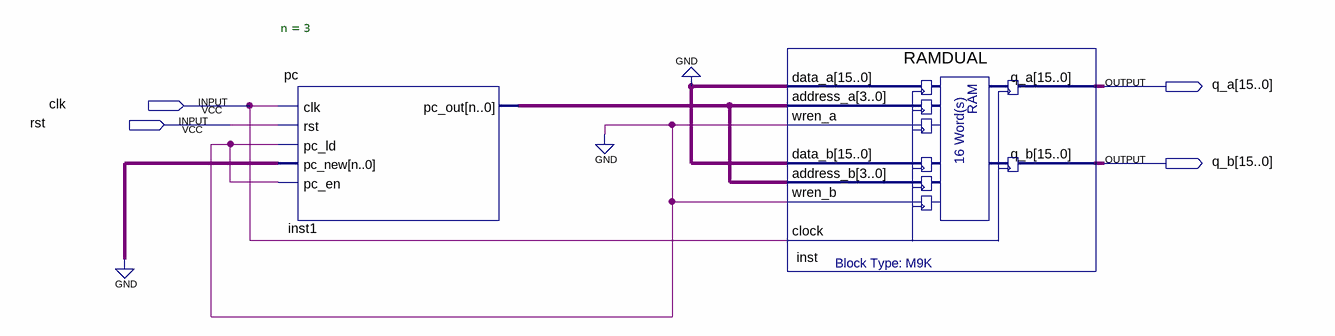
[diagram p0: schematic sheet]
// Quartus schematic memtest.bdf as structural Verilog: 2 symbols, 4 pins
module memtest (
  input  clk,
  input  rst,
  output [15:0] q_a,
  output [15:0] q_b
);

  wire [3:0] inst1_pc_out;

  pc #(.n(3)) inst1 (.clk(clk), .rst(rst), .pc_ld(1'b0), .pc_new(4'b0000), .pc_en(1'b0), .pc_out(inst1_pc_out));
  RAMDUAL inst (
    .data_a({16{1'b0}}), .address_a(inst1_pc_out), .wren_a(1'b0), .data_b({16{1'b0}}),
    .address_b(inst1_pc_out), .wren_b(1'b0), .clock(clk), .q_a(q_a), .q_b(q_b));
endmodule
